# EAGLE design monroe-lo (EAGLE 6.3)
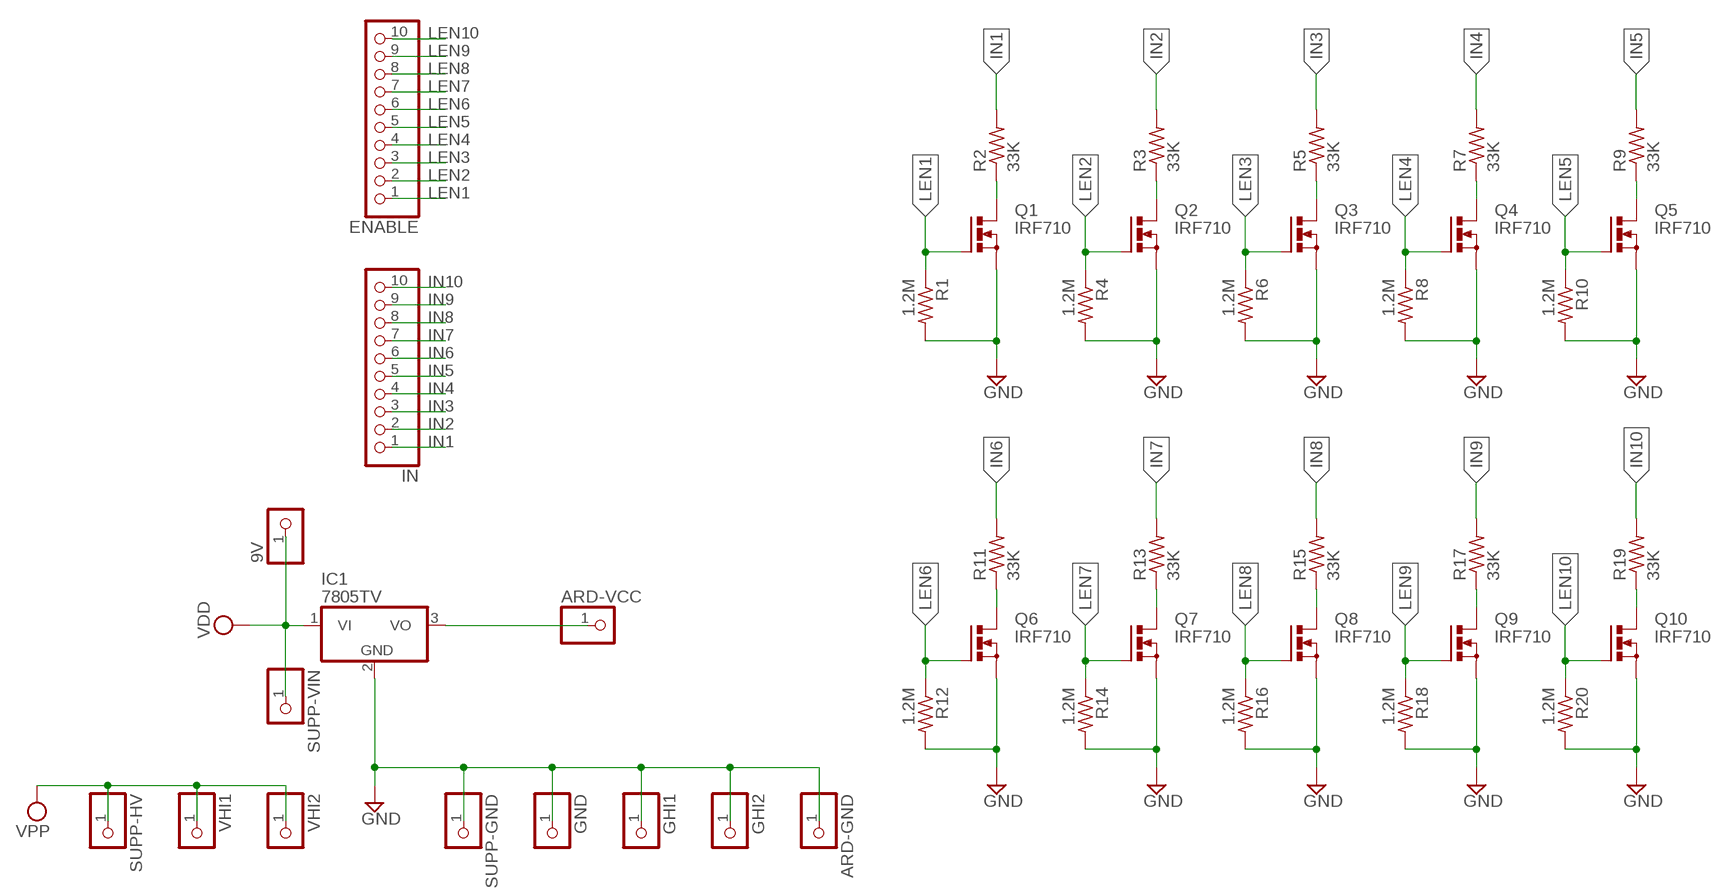
[diagram p0: schematic, sheet 1]

## Parts
9V  PINHD-1X1  [1X01]
ARD-GND  PINHD-1X1  [1X01]
ARD-VCC  PINHD-1X1  [1X01]
ENABLE  PINHD-1X10  [1X10]
GHI1  PINHD-1X1  [1X01]
GHI2  PINHD-1X1  [1X01]
GND  PINHD-1X1  [1X01]
IC1  7805TV  [TO220V]
IN  PINHD-1X10  [1X10]
Q1  IRF710  PMOSFET_NTO220BV  [TO220BV]
Q2  IRF710  PMOSFET_NTO220BV  [TO220BV]
Q3  IRF710  PMOSFET_NTO220BV  [TO220BV]
Q4  IRF710  PMOSFET_NTO220BV  [TO220BV]
Q5  IRF710  PMOSFET_NTO220BV  [TO220BV]
Q6  IRF710  PMOSFET_NTO220BV  [TO220BV]
Q7  IRF710  PMOSFET_NTO220BV  [TO220BV]
Q8  IRF710  PMOSFET_NTO220BV  [TO220BV]
Q9  IRF710  PMOSFET_NTO220BV  [TO220BV]
Q10  IRF710  PMOSFET_NTO220BV  [TO220BV]
R1  1.2M  R-US_0207/2V  [0207/2V]
R2  33K  R-US_0207/7  [0207/7]
R3  33K  R-US_0207/7  [0207/7]
R4  1.2M  R-US_0207/2V  [0207/2V]
R5  33K  R-US_0207/7  [0207/7]
R6  1.2M  R-US_0207/2V  [0207/2V]
R7  33K  R-US_0207/7  [0207/7]
R8  1.2M  R-US_0207/2V  [0207/2V]
R9  33K  R-US_0207/7  [0207/7]
R10  1.2M  R-US_0207/2V  [0207/2V]
R11  33K  R-US_0207/7  [0207/7]
R12  1.2M  R-US_0207/2V  [0207/2V]
R13  33K  R-US_0207/7  [0207/7]
R14  1.2M  R-US_0207/2V  [0207/2V]
R15  33K  R-US_0207/7  [0207/7]
R16  1.2M  R-US_0207/2V  [0207/2V]
R17  33K  R-US_0207/7  [0207/7]
R18  1.2M  R-US_0207/2V  [0207/2V]
R19  33K  R-US_0207/7  [0207/7]
R20  1.2M  R-US_0207/2V  [0207/2V]
SUPP-GND  PINHD-1X1  [1X01]
SUPP-HV  PINHD-1X1  [1X01]
SUPP-VIN  PINHD-1X1  [1X01]
VHI1  PINHD-1X1  [1X01]
VHI2  PINHD-1X1  [1X01]

## Nets
GND: ARD-GND.1 GHI1.1 GHI2.1 GND.1 IC1.2(GND) Q1.S Q2.S Q3.S Q4.S Q5.S Q6.S Q7.S Q8.S Q9.S Q10.S R1.2 R4.2 R6.2 R8.2 R10.2 R12.2 R14.2 R16.2 R18.2 R20.2 SUPP-GND.1
IN1: IN.1 R2.2
IN2: IN.2 R3.2
IN3: IN.3 R5.2
IN4: IN.4 R7.2
IN5: IN.5 R9.2
IN6: IN.6 R11.2
IN7: IN.7 R13.2
IN8: IN.8 R15.2
IN9: IN.9 R17.2
IN10: IN.10 R19.2
LEN1: ENABLE.1 Q1.G R1.1
LEN2: ENABLE.2 Q2.G R4.1
LEN3: ENABLE.3 Q3.G R6.1
LEN4: ENABLE.4 Q4.G R8.1
LEN5: ENABLE.5 Q5.G R10.1
LEN6: ENABLE.6 Q6.G R12.1
LEN7: ENABLE.7 Q7.G R14.1
LEN8: ENABLE.8 Q8.G R16.1
LEN9: ENABLE.9 Q9.G R18.1
LEN10: ENABLE.10 Q10.G R20.1
N$1: Q2.D R3.1
N$2: Q1.D R2.1
N$3: Q3.D R5.1
N$4: Q4.D R7.1
N$5: Q5.D R9.1
N$6: Q6.D R11.1
N$7: Q7.D R13.1
N$8: Q8.D R15.1
N$9: Q9.D R17.1
N$10: Q10.D R19.1
N$12: ARD-VCC.1 IC1.3(VO)
VDD: 9V.1 IC1.1(VI) SUPP-VIN.1
VPP: SUPP-HV.1 VHI1.1 VHI2.1

## Library data of the parts
9V ARD-GND ARD-VCC GHI1 GHI2 GND SUPP-GND SUPP-HV SUPP-VIN VHI1 VHI2 = pinhead:PINHD-1X1: PIN HEADER
ENABLE IN = pinhead:PINHD-1X10: PIN HEADER
IC1 = linear:78*: Positive VOLTAGE REGULATOR Source: http://cache.national.com/ds/LM/LM78L05.pdf http://www.fairchildsemi.com/ds/LM/LM7805.pdf
Q1-Q10 = transistor-power:PMOSFET_N: Power MOSFET N-Channel
R1-R20 = resistor:R-US_: RESISTOR, American symbol

## Board
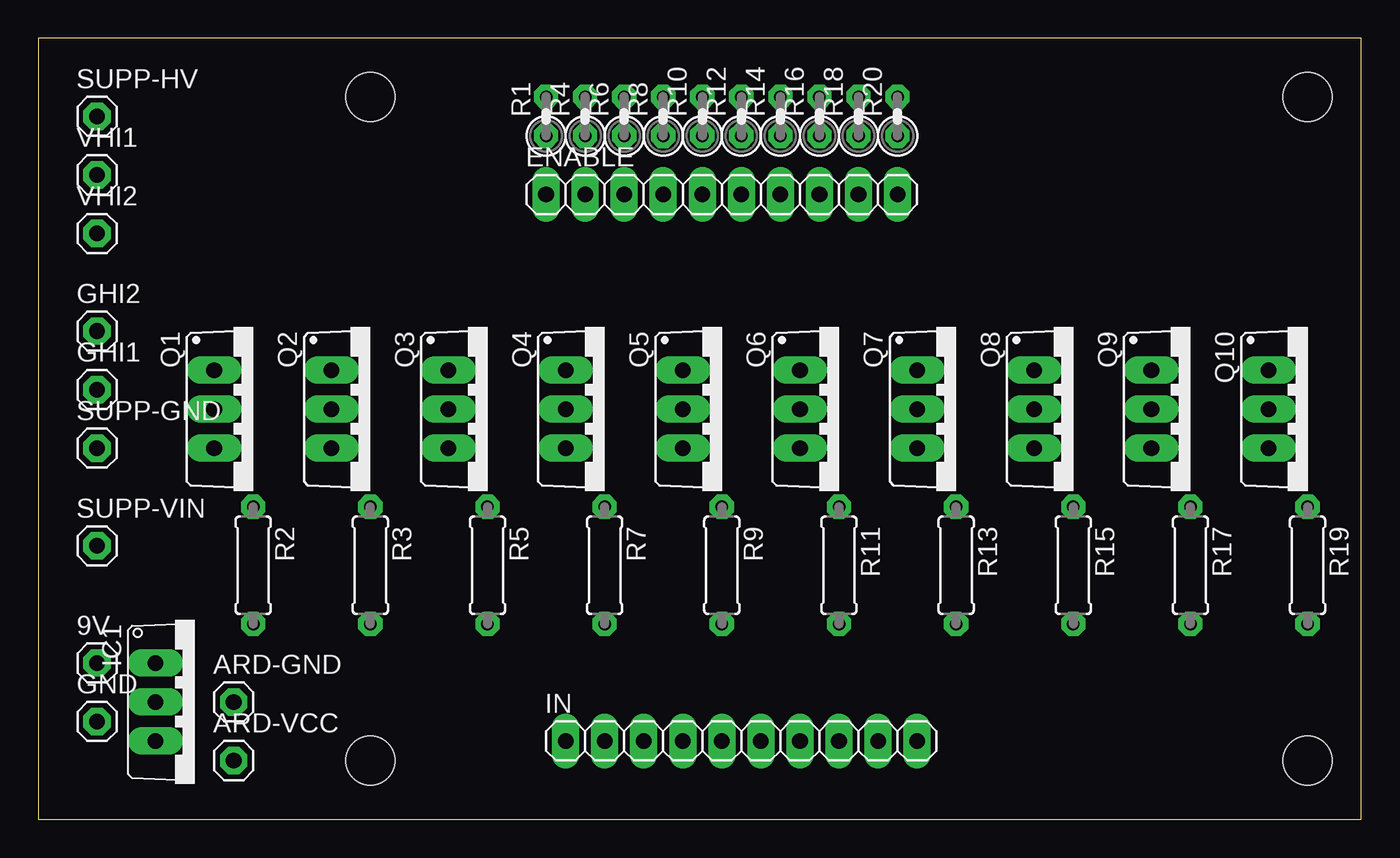
[diagram p1: board, top side]
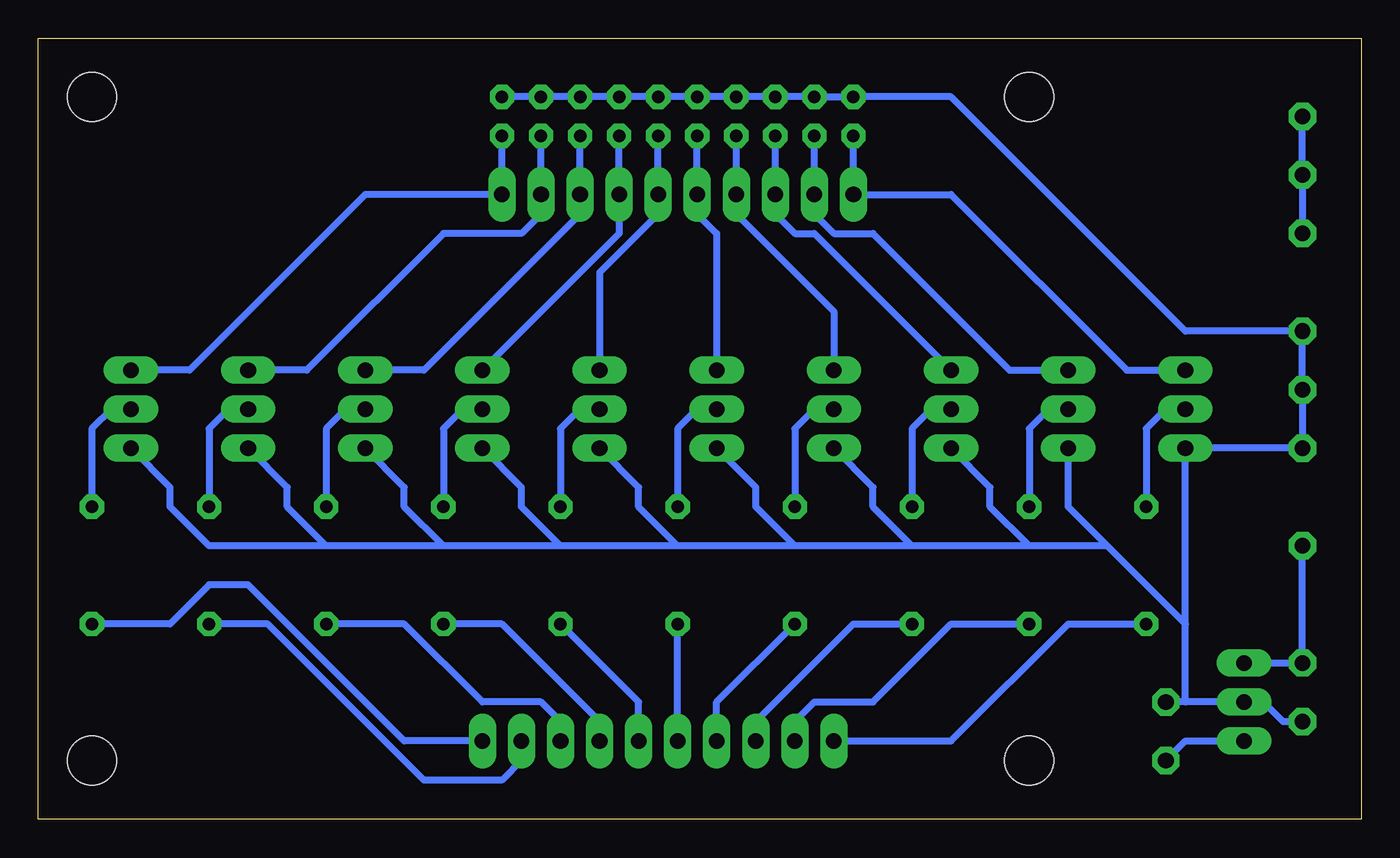
[diagram p2: board, bottom side, seen from below]

Size 86.03 x 50.79 mm. Coordinates in mm from the lower left corner, seen from the top.
Outline: 0,0 86.03,0 86.03,50.79 0,50.79 0,0
Copper layers (1*16): Top 0.035mm / dielectric 1.5mm / Bottom 0.035mm
Design rules "default *": minimum track width 18mil, minimum drill 24mil, track to track 14mil, track to pad 12mil, pad to pad 12mil, via to via 12mil, smd to smd 12mil, copper to edge 40mil, drill to drill 8mil, minimum pad ring 15mil, minimum via ring 8mil, stop-mask expansion 4mil, vias tented up to drill 0mil, thermal gap 10mil
Holes 3.2 mm at 21.59,46.99 82.55,46.99 82.55,3.81 21.59,3.81

### Footprints (pad centres in the part's own frame; a part is rotated, then mirrored left to right if it is on the bottom)
1X01 = drill 1.016 octagon: 1 0,0
1X10 = drill 1.016 long: 1 -11.43,0; 2 -8.89,0; 3 -6.35,0; 4 -3.81,0; 5 -1.27,0; 6 1.27,0; 7 3.81,0; 8 6.35,0; 9 8.89,0; 10 11.43,0
TO220V = drill 1.016 long: 1 -2.54,-2.54; 2 0,-2.54; 3 2.54,-2.54
TO220BV = drill 1.016 long: D 0,-2.54; G -2.54,-2.54; S 2.54,-2.54
0207/2V = drill 0.813 octagon: 1 -1.27,0; 2 1.27,0
0207/7 = drill 0.813 octagon: 1 -3.81,0; 2 3.81,0

### Placement (x,y rotation side)
9V  3.81,10.16 0 top
ARD-GND  12.7,7.62 0 top
ARD-VCC  12.7,3.81 0 top
ENABLE  44.45,40.64 0 top
GHI1  3.81,27.94 0 top
GHI2  3.81,31.75 0 top
GND  3.81,6.35 0 top
IC1  10.16,7.62 270 top
IN  45.72,5.08 0 top
Q1  13.97,26.67 270 top
Q2  21.59,26.67 270 top
Q3  29.21,26.67 270 top
Q4  36.83,26.67 270 top
Q5  44.45,26.67 270 top
Q6  52.07,26.67 270 top
Q7  59.69,26.67 270 top
Q8  67.31,26.67 270 top
Q9  74.93,26.67 270 top
Q10  82.55,26.67 270 top
R1  33.02,45.72 90 top
R2  13.97,16.51 270 top
R3  21.59,16.51 270 top
R4  35.56,45.72 90 top
R5  29.21,16.51 270 top
R6  38.1,45.72 90 top
R7  36.83,16.51 270 top
R8  40.64,45.72 90 top
R9  44.45,16.51 270 top
R10  43.18,45.72 90 top
R11  52.07,16.51 270 top
R12  45.72,45.72 90 top
R13  59.69,16.51 270 top
R14  48.26,45.72 90 top
R15  67.31,16.51 270 top
R16  50.8,45.72 90 top
R17  74.93,16.51 270 top
R18  53.34,45.72 90 top
R19  82.55,16.51 270 top
R20  55.88,45.72 90 top
SUPP-GND  3.81,24.13 0 top
SUPP-HV  3.81,45.72 0 top
SUPP-VIN  3.81,17.78 0 top
VHI1  3.81,41.91 0 top
VHI2  3.81,38.1 0 top

### Tracks (layer width: path | path; a pad name or v marks a point on that pad's centre or on a via)
GND
  Bottom 0.457: R20.2 R18.2 R16.2 R14.2 R12.2 R10.2 R8.2 R6.2 R4.2 R1.2 26.67,46.99 11.43,31.75 GHI2.1 GHI1.1 SUPP-GND.1 Q1.S 11.43,12.7 | GND.1 5.08,6.35 6.35,7.62 IC1.2 11.43,7.62 | 11.43,7.62 ARD-GND.1 | Q2.S 19.05,20.32 16.51,17.78 | 11.43,12.7 16.51,17.78 | 11.43,7.62 11.43,12.7 | Q3.S 24.13,21.59 24.13,20.32 21.59,17.78 | 16.51,17.78 21.59,17.78 | Q4.S 31.75,21.59 31.75,20.32 29.21,17.78 | 21.59,17.78 29.21,17.78 | Q5.S 39.37,21.59 39.37,20.32 36.83,17.78 | 29.21,17.78 36.83,17.78 | Q6.S 46.99,21.59 46.99,20.32 44.45,17.78 | 36.83,17.78 44.45,17.78 | Q7.S 54.61,21.59 54.61,20.32 52.07,17.78 | 44.45,17.78 52.07,17.78 | Q8.S 62.23,21.59 62.23,20.32 59.69,17.78 | 52.07,17.78 59.69,17.78 | Q9.S 69.85,21.59 69.85,20.32 67.31,17.78 | 59.69,17.78 67.31,17.78 | Q10.S 77.47,21.59 77.47,20.32 74.93,17.78 67.31,17.78
IN1
  Bottom 0.457: R2.2 19.05,12.7 26.67,5.08 IN.1
IN2
  Bottom 0.457: R3.2 26.67,12.7 31.75,7.62 35.56,7.62 36.83,6.35 IN.2
IN3
  Bottom 0.457: R5.2 33.02,12.7 39.37,6.35 IN.3
IN4
  Bottom 0.457: R7.2 41.91,7.62 IN.4
IN5
  Bottom 0.457: IN.5 R9.2
IN6
  Bottom 0.457: R11.2 46.99,7.62 IN.6
IN7
  Bottom 0.457: R13.2 55.88,12.7 49.53,6.35 IN.7
IN8
  Bottom 0.457: R15.2 62.23,12.7 57.15,7.62 53.34,7.62 52.07,6.35 IN.8
IN9
  Bottom 0.457: R17.2 71.12,12.7 60.96,2.54 55.88,2.54 54.61,3.81 IN.9
IN10
  Bottom 0.457: R19.2 77.47,12.7 74.93,15.24 72.39,15.24 62.23,5.08 IN.10
LEN1
  Bottom 0.457: R1.1 ENABLE.1 26.67,40.64 15.24,29.21 Q1.G
LEN2
  Bottom 0.457: R4.1 ENABLE.2 35.56,39.37 34.29,38.1 31.75,38.1 22.86,29.21 Q2.G
LEN3
  Bottom 0.457: R6.1 ENABLE.3 38.1,39.37 36.83,38.1 35.56,38.1 Q3.G
LEN4
  Bottom 0.457: R8.1 ENABLE.4 40.64,39.37 34.29,33.02 Q4.G
LEN5
  Bottom 0.457: R10.1 ENABLE.5 43.18,39.37 41.91,38.1 Q5.G
LEN6
  Bottom 0.457: R12.1 ENABLE.6 45.72,39.37 49.53,35.56 Q6.G
LEN7
  Bottom 0.457: R14.1 ENABLE.7 48.26,38.1 Q7.G
LEN8
  Bottom 0.457: R16.1 ENABLE.8 50.8,39.37 60.96,29.21 Q8.G
LEN9
  Bottom 0.457: R18.1 ENABLE.9 53.34,39.37 54.61,38.1 59.69,38.1 68.58,29.21 Q9.G
LEN10
  Bottom 0.457: R20.1 ENABLE.10 64.77,40.64 76.2,29.21 Q10.G
N$1
  Bottom 0.457: R3.1 21.59,25.4 20.32,26.67 Q2.D
N$2
  Bottom 0.457: R2.1 13.97,25.4 12.7,26.67 Q1.D
N$3
  Bottom 0.457: R5.1 29.21,25.4 27.94,26.67 Q3.D
N$4
  Bottom 0.457: R7.1 36.83,25.4 35.56,26.67 Q4.D
N$5
  Bottom 0.457: R9.1 44.45,25.4 43.18,26.67 Q5.D
N$6
  Bottom 0.457: R11.1 52.07,25.4 50.8,26.67 Q6.D
N$7
  Bottom 0.457: R13.1 59.69,25.4 58.42,26.67 Q7.D
N$8
  Bottom 0.457: R15.1 67.31,25.4 66.04,26.67 Q8.D
N$9
  Bottom 0.457: R17.1 74.93,25.4 73.66,26.67 Q9.D
N$10
  Bottom 0.457: R19.1 82.55,25.4 81.28,26.67 Q10.D
N$12
  Bottom 0.457: IC1.3 11.43,5.08 ARD-VCC.1
VDD
  Bottom 0.457: IC1.1 9V.1 SUPP-VIN.1
VPP
  Bottom 0.457: VHI2.1 VHI1.1 SUPP-HV.1